# EAGLE design wmk (EAGLE 9.6.2)
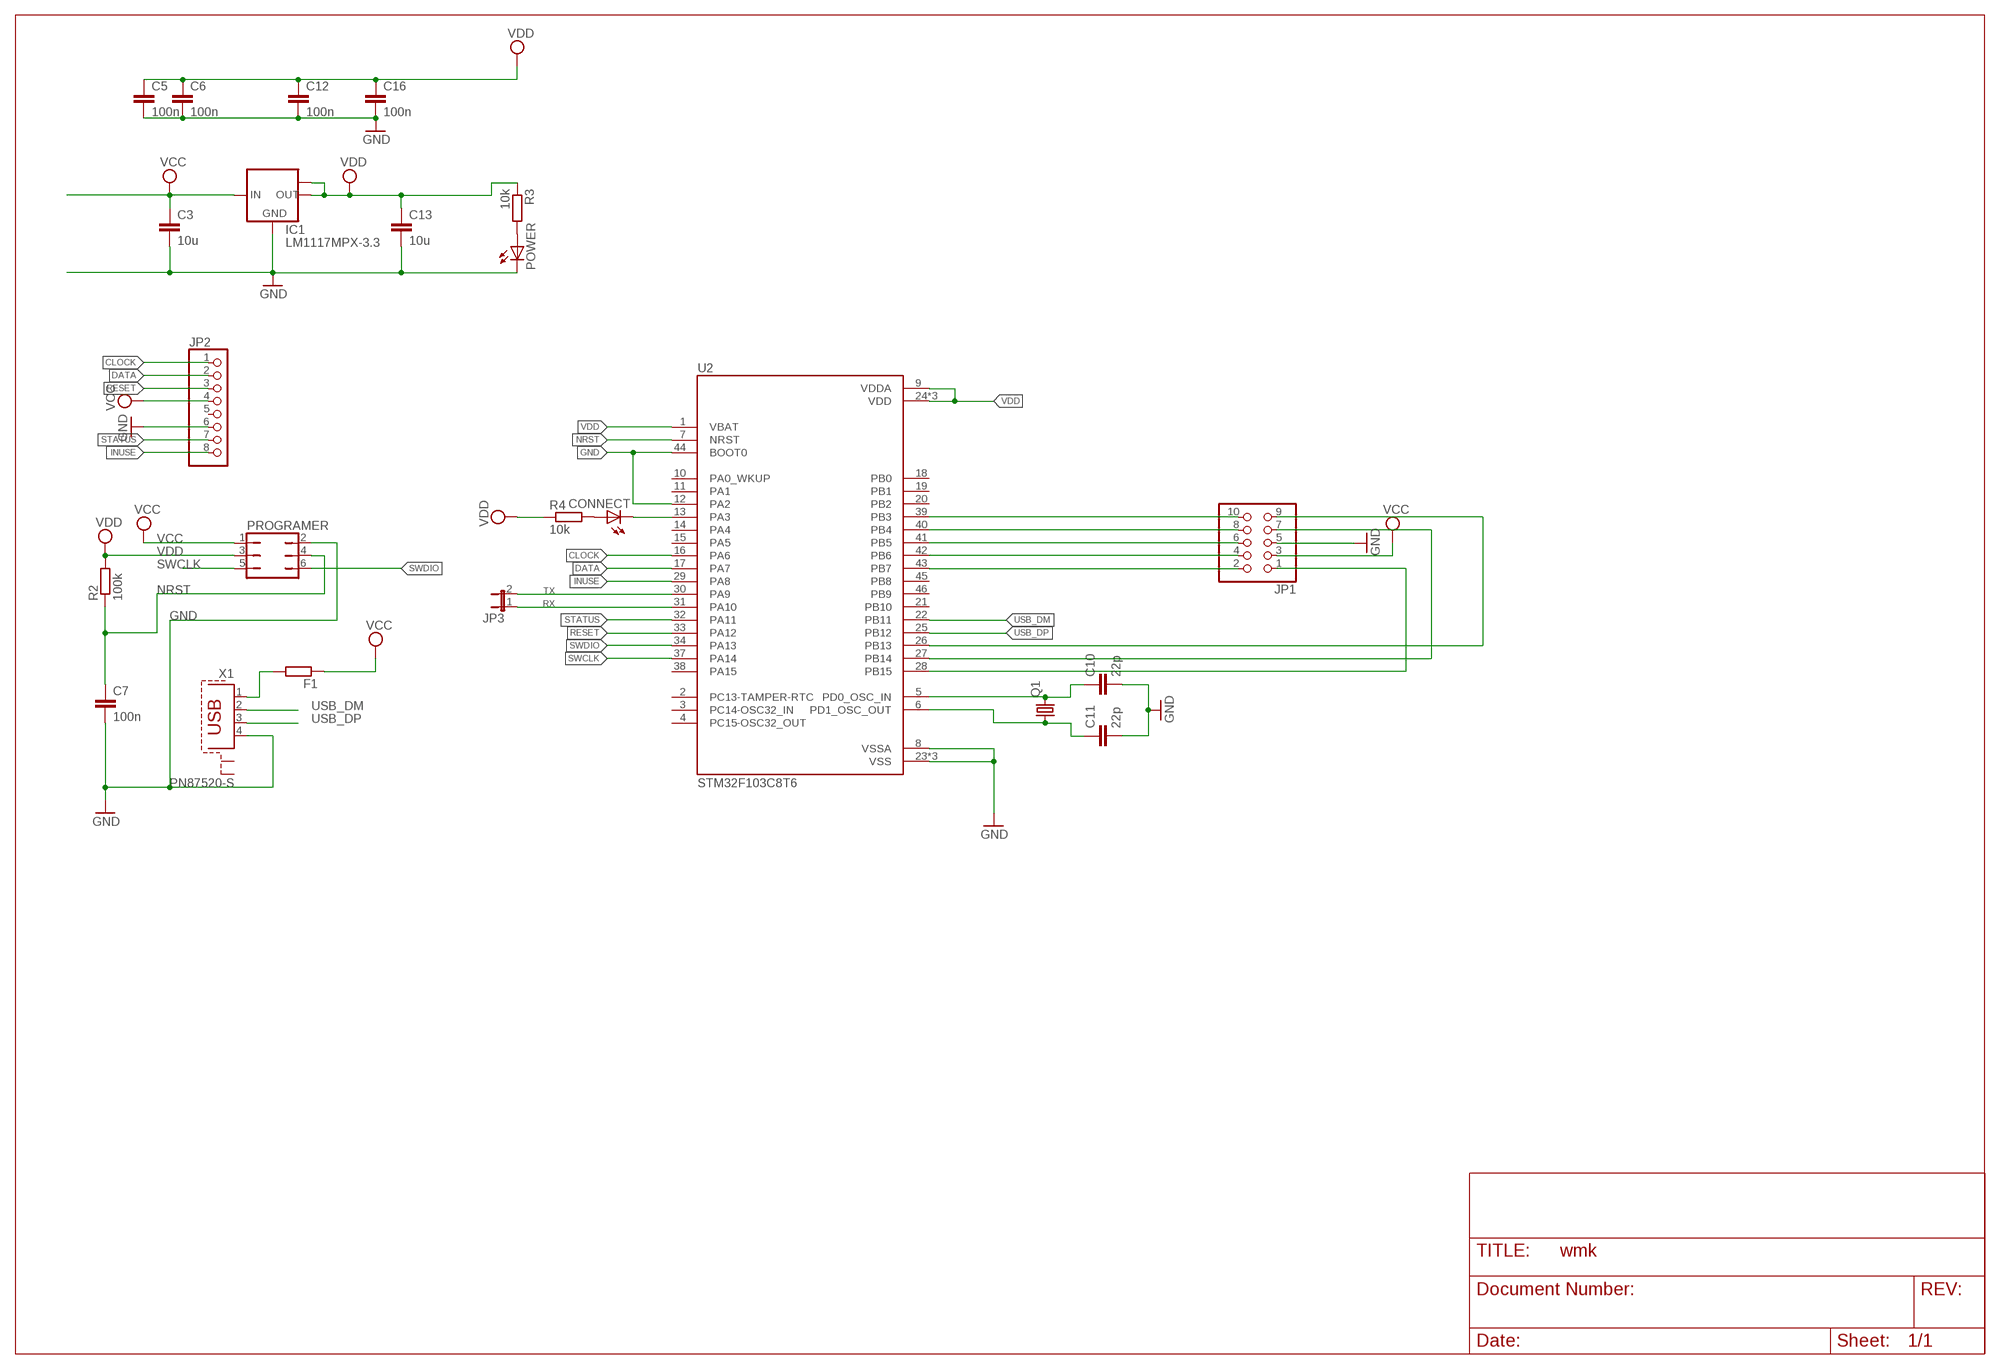
[diagram p0: schematic, sheet 1]

## Parts
C3  10u  C-EUC1206  [C1206]
C5  100n  C-EUC0603  [C0603]
C6  100n  C-EUC0603  [C0603]
C7  100n  C-EUC0603  [C0603]
C10  22p  C-EUC0603  [C0603]
C11  22p  C-EUC0603  [C0603]
C12  100n  C-EUC0603  [C0603]
C13  10u  C-EUC1206  [C1206]
C16  100n  C-EUC0603  [C0603]
CONNECT  LEDSML0805  [SML0805]
F1  RR1206  [R1206]
IC1  LM1117MPX-3.3  [SOT223]
JP1  PINHD-2X5  [2X05]
JP2  PINHD-1X8  [1X08]
JP3  JP1E  [JP1]
POWER  LEDSML0805  [SML0805]
PROGRAMER  JP3Q  [JP3Q]
Q1  CRYSTALHC49S  [HC49/S]
R2  100k  R-EU_R0603  [R0603]
R3  10k  R-EU_R0603  [R0603]
R4  10k  R-EU_R0603  [R0603]
U2  STM32F103C8T6  [QFP50P900X900X160-48N]
X1  PN87520-S  [PN87520-S]

## Nets
CLOCK: JP2.1 U2.16(PA6)
DATA: JP2.2 U2.17(PA7)
GND: C3.2 C5.2 C6.2 C7.2 C10.2 C11.2 C12.2 C13.2 C16.2 IC1.1(GND) JP1.5 JP2.6 POWER.C PROGRAMER.2 U2.8(VSSA) U2.12(PA2) U2.23(VSS) U2.35(VSS) U2.44(BOOT0) U2.47(VSS) X1.4
INUSE: JP2.8 U2.29(PA8)
N$1: C10.1 Q1.2 U2.5(PD0_OSC_IN)
N$2: C11.1 Q1.1 U2.6(PD1_OSC_OUT)
N$3: CONNECT.C U2.13(PA3)
N$4: F1.2 X1.1
N$6: JP1.10 U2.39(PB3)
N$7: CONNECT.A R4.2
N$8: JP1.8 U2.40(PB4)
N$9: JP1.6 U2.41(PB5)
N$10: JP1.4 U2.42(PB6)
N$11: JP1.2 U2.43(PB7)
N$12: POWER.A R3.2
N$13: JP1.7 U2.27(PB14)
N$15: JP1.9 U2.26(PB13)
N$36: JP1.1 U2.28(PB15)
NRST: C7.1 PROGRAMER.4 R2.1 U2.7(NRST)
RESET: JP2.3 U2.33(PA12)
RX: JP3.1 U2.31(PA10)
STATUS: JP2.7 U2.32(PA11)
SWCLK: PROGRAMER.5 U2.37(PA14)
SWDIO: PROGRAMER.6 U2.34(PA13)
TX: JP3.2 U2.30(PA9)
USB_DM: U2.22(PB11) X1.2
USB_DP: U2.25(PB12) X1.3
VCC: C3.1 F1.1 IC1.3(IN) JP1.3 JP2.4 PROGRAMER.1
VDD: C5.1 C6.1 C12.1 C13.1 C16.1 IC1.2(OUT) IC1.TAB(OUT1) PROGRAMER.3 R2.2 R3.1 R4.1 U2.1(VBAT) U2.9(VDDA) U2.24(VDD) U2.36(VDD) U2.48(VDD)
Unconnected: JP2.5 U2.2(PC13-TAMPER-RTC) U2.3(PC14-OSC32_IN) U2.4(PC15-OSC32_OUT) U2.10(PA0_WKUP) U2.11(PA1) U2.14(PA4) U2.15(PA5) U2.18(PB0) U2.19(PB1) U2.20(PB2) U2.21(PB10) U2.38(PA15) U2.45(PB8) U2.46(PB9) X1.S1 X1.S2

## Library data of the parts
C3 C5-C7 C10-C13 C16 = rcl:C-EU: CAPACITOR, European symbol; SPICEPREFIX: C
CONNECT POWER = led:LED: LED OSRAM: - CHIPLED LG R971, LG N971, LY N971, LG Q971, LY Q971, LO R971, LY R971 LH N974, LH R974 LS Q976, LO Q976, LY Q976 LO Q996 - Hyper CHIPLED LW Q18S LB Q993, LB Q99A, LB R99A - SideLED LS A670, LO A670, LY A670, LG A670, LP A670 LB A673, LV A673, LT A673, LW A673 LH A674 LY A675 LS A676, LA A676, LO A676, LY A676, LW A676 LS A679, LY A679, LG A679 - Hyper Micro SIDELED® LS Y876, LA Y876, LO Y876, LY Y876 LT Y87S - SmartLED LW L88C, LW L88S LB L89C, LB L89S, LG L890 LS L89K, LO L89K, LY L89K LS L896, LA L896, LO L896, LY L896 - TOPLED LS T670, LO T670, LY T670, LG T670, LP T670 LSG T670, LSP T670, LSY T670, LOP T670, LYG T670 LG T671, LOG T671, LSG T671 LB T673, LV T673, LT T673, LW T673 LH T674 LS T676, LA T676, LO T676, LY T676, LB T676, LH T676, LSB T676, LW T676 LB T67C, LV T67C, LT T67C, LS T67K, LO T67K, LY T67K, LW E67C LS E67B, LA E67B, LO E67B, LY E67B, LB E67C, LV E67C, LT E67C LW T67C LS T679, LY T679, LG T679 LS T770, LO T770, LY T770, LG T770, LP T770 LB T773, LV T773, LT T773, LW T773 LH T774 LS E675, LA E675, LY E675, LS T675 LS T776, LA T776, LO T776, LY T776, LB T776 LHGB T686 LT T68C, LB T68C - Hyper Mini TOPLED® LB M676 - Mini TOPLED Santana® LG M470 LS M47K, LO M47K, LY M47K Source: http://www.osram.convergy.de LUXEON: - LUMILED® LXK2-PW12-R00, LXK2-PW12-S00, LXK2-PW14-U00, LXK2-PW14-V00 LXK2-PM12-R00, LXK2-PM12-S00, LXK2-PM14-U00 LXK2-PE12-Q00, LXK2-PE12-R00, LXK2-PE12-S00, LXK2-PE14-T00, LXK2-PE14-U00 LXK2-PB12-K00, LXK2-PB12-L00, LXK2-PB12-M00, LXK2-PB14-N00, LXK2-PB14-P00, LXK2-PB14-Q00 LXK2-PR12-L00, LXK2-PR12-M00, LXK2-PR14-Q00, LXK2-PR14-R00 LXK2-PD12-Q00, LXK2-PD12-R00, LXK2-PD12-S00 LXK2-PH12-R00, LXK2-PH12-S00 LXK2-PL12-P00, LXK2-PL12-Q00, LXK2-PL12-R00 Source: www.luxeon.com KINGBRIGHT: KA-3528ASYC Source: www.kingbright.com
F1 = eagle-ltspice:R: RESISTOR, European symbol; SPICEMODEL: NONE; SPICEPREFIX: R
IC1 = lm1117:LM1117MPX-*
JP1 = pinhead:PINHD-2X5: PIN HEADER
JP2 = pinhead:PINHD-1X8: PIN HEADER
JP3 = jumper:JP1E: JUMPER
PROGRAMER = jumper:JP3Q: JUMPER
Q1 = crystal:CRYSTAL: CRYSTAL; OC_FARNELL: 1667008; OC_NEWARK: unknown
R2-R4 = rcl:R-EU_: RESISTOR, European symbol; SPICEPREFIX: R
U2 = STM32F103C8T6:STM32F103C8T6: Mainstream Performance line, ARM Cortex-M3 MCU with 64 Kbytes Flash, 72 MHz CPU, motor control, USB and CAN Check availability <https://pricing.snapeda.com/parts/STM32F103C8T6/STMicroelectronics/view-part?ref=eda>; AVAILABILITY: In Stock; DESCRIPTION: ARM® Cortex®-M3 STM32F1 Microcontroller IC 32-Bit 72MHz 64KB (64K x 8) FLASH 48-LQFP (7x7); MF: STMicroelectronics; MP: STM32F103C8T6; PACKAGE: LQFP-48 STMicroelectronics; PRICE: None; PURCHASE-URL: https://pricing.snapeda.com/search?q=STM32F103C8T6&ref=eda
X1 = con-berg:PN87520-S; OC_FARNELL: unknown; OC_NEWARK: unknown

## Board
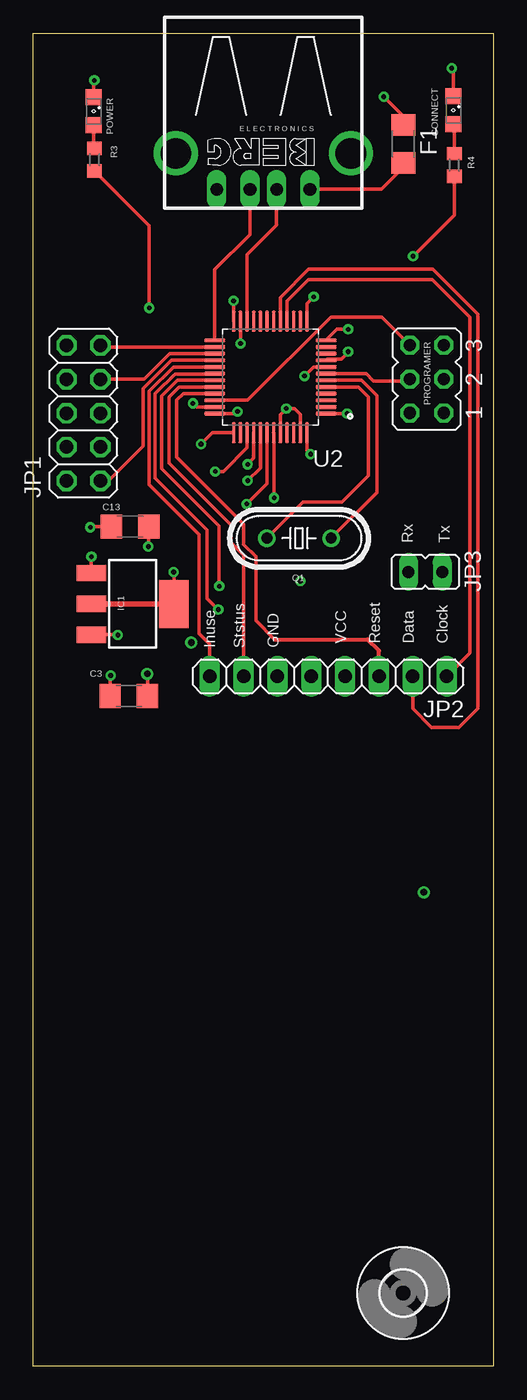
[diagram p1: board, top side]
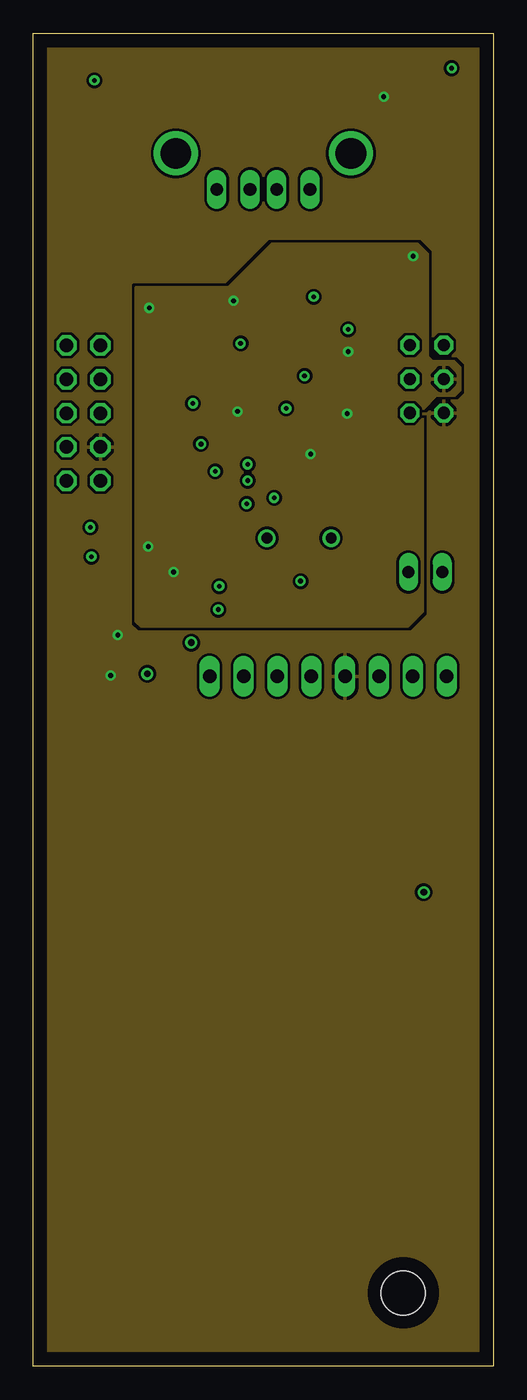
[diagram p2: board, inner layer PWR]
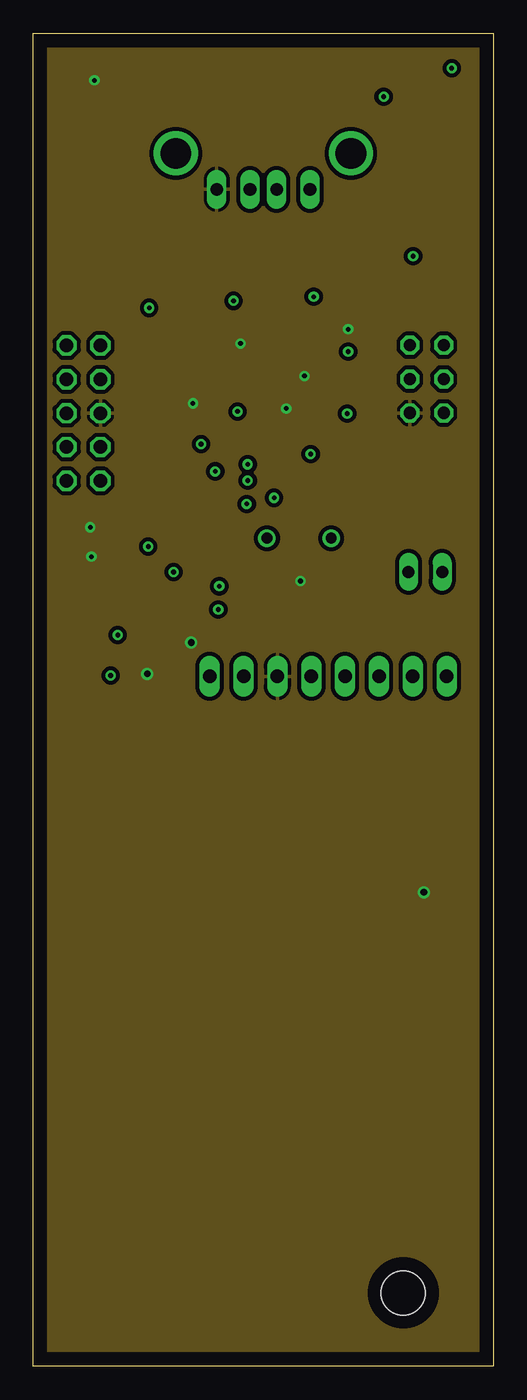
[diagram p3: board, inner layer GND]
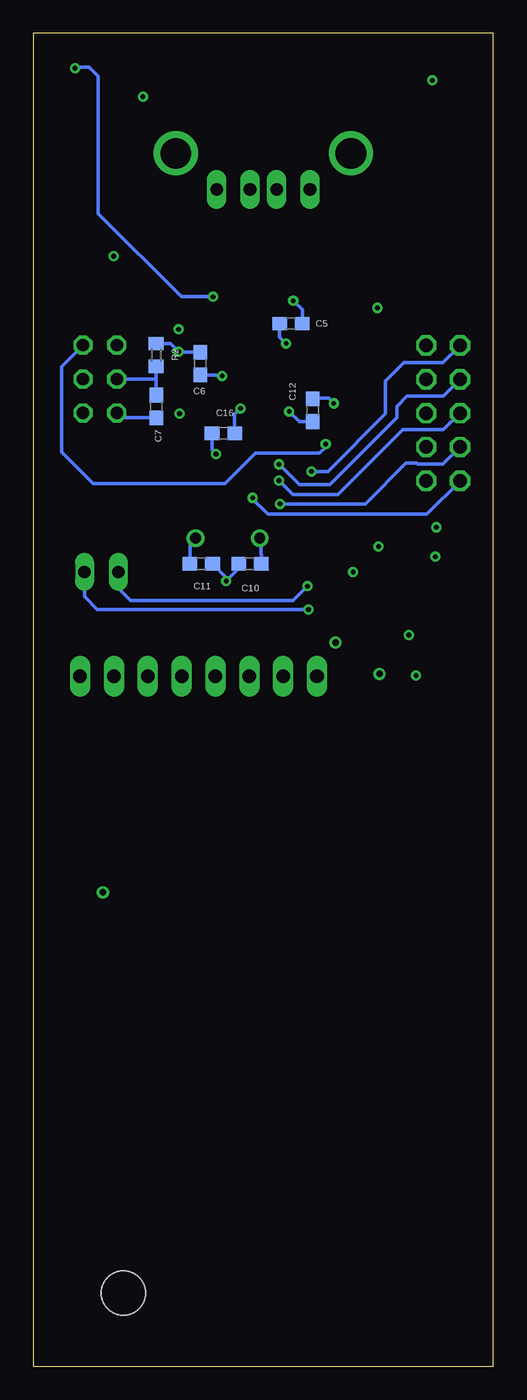
[diagram p4: board, bottom side, seen from below]

Size 34.54 x 100 mm. Coordinates in mm from the lower left corner, seen from the top.
Outline: 0,0 0,100 34.54,100 34.54,0 0,0
Copper layers (1*2*15*16): Top 0.035mm / dielectric 1.5mm / PWR 0.035mm / dielectric 0.15mm / GND 0.035mm / dielectric 0.2mm / Bottom 0.035mm
Design rules "default *": minimum track width 6mil, minimum drill 0.35mm, track to track 8mil, track to pad 6mil, pad to pad 6mil, via to via 6mil, smd to smd 6mil, copper to edge 40mil, drill to drill 6mil, minimum pad ring 10mil, minimum via ring 8mil, stop-mask expansion 4mil, vias tented up to drill 0mil, thermal gap 10mil

### Footprints (pad centres in the part's own frame; a part is rotated, then mirrored left to right if it is on the bottom)
C1206 = smd 1.6 x 1.8: 1 -1.4,0; 2 1.4,0
C0603 = smd 1.1 x 1: 1 -0.85,0; 2 0.85,0
SML0805 = smd 1.2 x 1.2: A 1.05,0; C -1.05,0
R1206 = smd 1.6 x 1.803: 1 -1.422,0; 2 1.422,0
SOT223 = smd 1.219 x 2.235: 1 -2.311,-3.099; 2 0,-3.099; 3 2.311,-3.099 | smd 3.6 x 2.2: TAB 0,3.099
2X05 = drill 1.016 octagon: 1 -5.08,-1.27; 2 -5.08,1.27; 3 -2.54,-1.27; 4 -2.54,1.27; 5 0,-1.27; 6 0,1.27; 7 2.54,-1.27; 8 2.54,1.27; 9 5.08,-1.27; 10 5.08,1.27
1X08 = drill 1.016 long: 1 -8.89,0; 2 -6.35,0; 3 -3.81,0; 4 -1.27,0; 5 1.27,0; 6 3.81,0; 7 6.35,0; 8 8.89,0
JP1 = drill 0.914 long: 1 0,-1.27; 2 0,1.27
JP3Q = drill 0.914 octagon: 1 -2.54,-1.27; 2 -2.54,1.27; 3 0,-1.27; 4 0,1.27; 5 2.54,-1.27; 6 2.54,1.27
HC49/S = drill 0.813: 1 -2.413,0; 2 2.413,0
R0603 = smd 1 x 1.1: 1 -0.85,0; 2 0.85,0
QFP50P900X900X160-48N = smd 1.56 x 0.28: 1 -4.18,2.75; 2 -4.18,2.25; 3 -4.18,1.75; 4 -4.18,1.25; 5 -4.18,0.75; 6 -4.18,0.25; 7 -4.18,-0.25; 8 -4.18,-0.75; 9 -4.18,-1.25; 10 -4.18,-1.75; 11 -4.18,-2.25; 12 -4.18,-2.75; 25 4.18,-2.75; 26 4.18,-2.25; 27 4.18,-1.75; 28 4.18,-1.25; 29 4.18,-0.75; 30 4.18,-0.25; 31 4.18,0.25; 32 4.18,0.75; 33 4.18,1.25; 34 4.18,1.75; 35 4.18,2.25; 36 4.18,2.75 | smd 0.28 x 1.56: 13 -2.75,-4.18; 14 -2.25,-4.18; 15 -1.75,-4.18; 16 -1.25,-4.18; 17 -0.75,-4.18; 18 -0.25,-4.18; 19 0.25,-4.18; 20 0.75,-4.18; 21 1.25,-4.18; 22 1.75,-4.18; 23 2.25,-4.18; 24 2.75,-4.18; 37 2.75,4.18; 38 2.25,4.18; 39 1.75,4.18; 40 1.25,4.18; 41 0.75,4.18; 42 0.25,4.18; 43 -0.25,4.18; 44 -0.75,4.18; 45 -1.25,4.18; 46 -1.75,4.18; 47 -2.25,4.18; 48 -2.75,4.18
3,3 = hole 3.3: 0,0
PN87520-S = drill 0.95 long: 1 -3.5,2.71; 2 -1,2.71; 3 1,2.71; 4 3.5,2.71 | drill 2.3 pad 2.9: S1 -6.57,0; S2 6.57,0

### Placement (x,y rotation side)
C3  7.17,50.28 0 top
C5  15.2,78.22 180 bottom
C6  22.01,75.22 270 bottom
C7  25.31,72 270 bottom
C10  18.27,60.2 180 bottom
C11  21.93,60.2 0 bottom
C12  13.56,71.72 90 bottom
C13  7.26,62.98 180 top
C16  20.27,69.99 0 bottom
CONNECT  31.54,94.22 270 top
F1  27.78,91.69 270 top
IC1  7.46,57.19 270 top
JP1  3.77,71.5 90 top
JP2  22.14,51.75 180 top
JP3  29.43,59.59 270 top
POWER  4.54,94.14 270 top
PROGRAMER  29.54,74.06 90 top
Q1  19.95,62.12 180 top
R2  25.32,75.87 90 bottom
R3  4.59,90.52 90 top
R4  31.6,90.12 90 top
U2  17.8,74.22 180 top
U$1  [3,3]  27.77,5.5 0 top
X1  17.27,91 180 top

### Tracks (layer width: path | path; a pad name or v marks a point on that pad's centre or on a via)
CLOCK
  Top 0.254: U2.16 19.05,79.91 20.67,81.53 29.96,81.53 32.78,78.71 32.78,53.51 JP2.1
DATA
  Top 0.254: U2.17 18.55,80.17 20.67,82.29 30.01,82.29 33.36,78.94 33.36,49.34 31.94,47.93 29.89,47.93 28.49,49.33 JP2.2
GND  (via drill 0.35, 0.5 pad 0.25)
  Top 0.254: U2.23 15.55,76.75 v15.56,76.73 | U2.35 12.25,71.97 v11.98,72.24 | C3.2 8.57,51.92 v8.55,51.94 | U2.44 18.55,71.41 v18.99,71.85 19.6,71.85 20.05,71.41 U2.47 | U2.8 21.04,74.97 v20.36,74.29 | C13.2 4.32,62.98 v4.28,62.94 | IC1.1 v4.36,60.73 | U2.12 22.81,77.8 v23.64,77.8 | POWER.C 4.54,96.42 v4.59,96.47
  Bottom 0.254: C5.2 16.05,77.22 v15.56,76.73 | C12.2 13.51,72.62 12.36,72.62 v11.98,72.24 | v18.99,71.85 19.42,71.42 C16.2 | v20.36,74.29 20.44,74.37 C6.2 | C10.2 19.12,59.83 v20.06,58.9 20.06,59.18 C11.2 | PROGRAMER.2 27.91,71.16 C7.2
  other vias: 11.85,54.29 29.32,35.56
  pour GND (isolate 0.305): 34.64,100.01 34.64,0 0.03,0 0.03,100.01
INUSE
  Top 0.254: JP2.8 13.25,54.18 12.44,54.99 12.44,62.41 8.7,66.14 8.7,73.15 10.52,74.97 U2.29
N$1
  Top 0.254: Q1.2 20.26,64.84 23.18,64.84 25.16,66.83 25.16,72.69 24.39,73.47 U2.5
  Bottom 0.254: C10.1 17.42,60.91 17.46,60.98 17.46,62.04 Q1.2
N$2
  Top 0.254: Q1.1 25.8,65.56 25.8,72.82 24.63,73.99 22,73.99 U2.6
  Bottom 0.254: C11.1 22.78,61.49 22.69,61.66 22.69,61.79 Q1.1
N$3  (via drill 0.35)
  Top 0.254: U2.13 20.55,79.74 v21.05,80.24 | v31.41,97.38 31.54,97.25 CONNECT.C
  Bottom 0.254: v21.05,80.24 23.41,80.24 29.66,86.48 29.66,96.77 30.34,97.46 31.33,97.46 v31.41,97.38
N$4
  Top 0.254: F1.2 27.76,89.91 26.14,88.29 X1.1
N$6  (via drill 0.35)
  Top 0.254: U2.39 16.05,68.91 14.27,67.13 v13.66,67.13
  Bottom 0.254: JP1.10 3.8,75.28 6.72,75.28 8.09,73.91 8.09,71.47 12.44,67.13 v13.66,67.13
N$7
  Top 0.254: CONNECT.A 31.6,93.11 R4.2
N$8  (via drill 0.35)
  Top 0.254: U2.40 16.55,68.12 v16.09,67.66
  Bottom 0.254: JP1.8 3.77,72.77 6.49,72.77 7.26,72.01 7.26,71.17 12.28,66.14 14.57,66.14 v16.09,67.66
N$9  (via drill 0.35)
  Top 0.254: v16.09,66.44 17.05,67.4 U2.41
  Bottom 0.254: JP1.6 3.75,70.25 6.8,70.25 11.68,65.38 15.03,65.38 v16.09,66.44
N$10  (via drill 0.35)
  Top 0.254: v16.02,64.69 17.55,66.22 U2.42
  Bottom 0.254: JP1.4 3.8,67.66 5.66,67.66 5.73,67.74 6.57,67.74 9.62,64.69 v16.02,64.69
N$11  (via drill 0.35)
  Top 0.254: v18.08,65.15 18.08,70.01 U2.43
  Bottom 0.254: JP1.2 4.99,63.93 16.93,63.93 18.08,65.07 v18.08,65.15
N$12
  Top 0.254: POWER.A 4.54,91.42 R3.2
N$13
  Top 0.254: JP1.7 8.3,74.04 10.23,75.97 U2.27
N$15
  Top 0.254: JP1.9 5.15,76.47 U2.26
N$36
  Top 0.254: JP1.1 5.63,66.42 8.25,69.03 8.25,73.34 10.37,75.47 U2.28
NRST
  Top 0.254: U2.7 24.99,74.47 25.54,73.91 28.12,73.91 PROGRAMER.4
  Bottom 0.254: R2.1 25.32,74.06 | 25.32,74.06 C7.1 | 25.32,74.06 PROGRAMER.4
RESET
  Top 0.254: U2.33 11.26,72.97 10.76,72.46 10.76,68.2 15.79,63.17 15.79,61.64 16.7,60.73 16.7,55.94 18.11,54.53
  Top 0.305: JP2.3 25.95,53.68 25.1,54.53 18.11,54.53
RX  (via drill 0.35)
  Top 0.254: v13.96,58.52 13.96,63.02 9.62,67.36 9.62,72.77 10.81,73.97 U2.31
  Bottom 0.254: v13.96,58.52 15.03,57.45 27.22,57.45 28.16,58.39 JP3.1
STATUS
  Top 0.254: JP2.7 15.79,60.84 14.85,61.78 14.85,63.12 10.2,67.76 10.2,72.71 10.96,73.47 U2.32
SWCLK  (via drill 0.35)
  Top 0.254: v12.59,69.19 13.44,70.04 U2.37
  Bottom 0.254: PROGRAMER.5 32.4,75.01 32.4,68.58 30.04,66.22 20.13,66.22 17.85,68.5 13.05,68.5 12.59,68.96 v12.59,69.19
SWDIO
  Top 0.254: U2.34 16.1,72.47 22.34,78.71 26.16,78.71 PROGRAMER.6
TX  (via drill 0.35)
  Top 0.254: U2.30 13.6,74.45 10.65,74.45 9.16,72.96 9.16,66.63 13.05,62.75 13.05,57.6 v13.88,56.77
  Bottom 0.254: v13.88,56.77 29.73,56.77 30.7,57.73 JP3.2
USB_DM
  Top 0.254: U2.22 16.05,83.39 18.27,85.61 X1.2
USB_DP
  Top 0.254: X1.3 16.27,84.91 13.62,82.25 U2.25
VCC  (via drill 0.35)
  Top 0.254: IC1.3 6.32,54.88 v6.34,54.86 | C3.1 5.77,51.78 v5.81,51.81 | v26.31,95.25 27.78,93.77 F1.1
  pour PWR (isolate 0.203, rank 2): 0.02,99.97 34.46,99.97 34.61,99.82 34.61,0.15 34.46,0 0.24,0 0.02,0.23 0.02,99.74
VDD  (via drill 0.35)
  Top 0.254: U2.24 15.05,79.91 v15.03,79.93 | v20.82,68.43 20.55,68.7 U2.48 | U2.9 22.06,75.55 23.14,75.55 23.64,76.05 v23.64,76.12 | v15.33,71.63 15.17,71.47 U2.36 | IC1.TAB 10.56,59.56 v10.53,59.59 | C13.1 8.66,61.53 v8.63,61.49 | U2.1 v23.56,71.47 | v8.7,79.4 8.7,85.55 R3.1 | R4.1 31.6,86.37 v28.52,83.28
  Top 0.406: IC1.2 IC1.TAB
  Bottom 0.254: C5.1 14.35,79.25 v15.03,79.93 | C16.1 21.12,68.73 v20.82,68.43 | C6.1 23.58,76.07 v23.64,76.12 24.24,76.72 R2.2 | C12.1 14.57,70.87 v15.33,71.63
  pour PWR (isolate 0.203): 8.09,55.55 28.13,55.55 29.2,56.61 29.2,71.78 30.27,72.84 31.64,72.84 32.02,73.23 32.02,74.9 31.56,75.36 29.96,75.36 29.58,75.74 29.58,83.44 28.82,84.2 17.92,84.2 14.65,80.92 7.71,80.92 7.71,55.85

### Text on the board
tNames: Rx | Tx | Inuse | Ststus | GND | VCC | Reset | Data | Clock
tValues: SWCLK | SWDIO | NRST | GND | VCC | ReAmiga 1200 Mouse USB | 3/5/2021